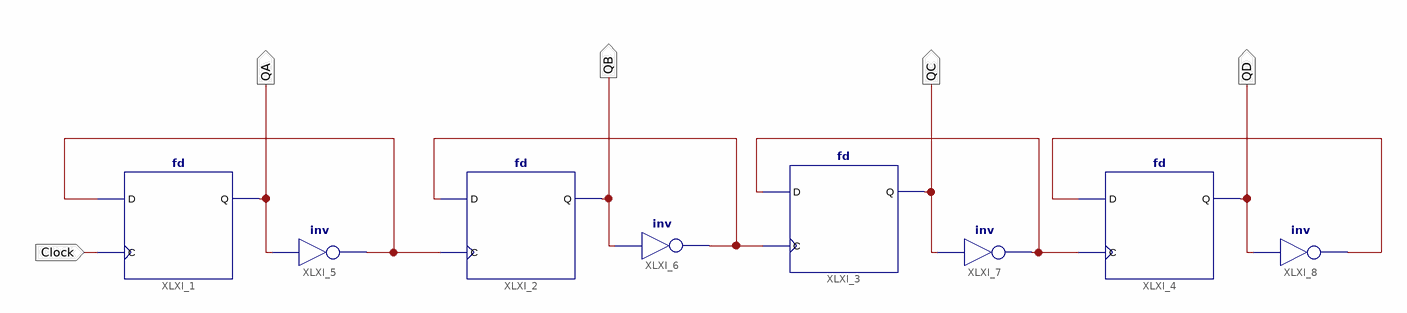
[diagram p0: schematic sheet 1]
// Xilinx ISE schematic counter.sch (spartan3a) as structural Verilog: 8 symbols, 5 ports
module counter (
  input  Clock,
  output QB,
  output QC,
  output QD,
  output QA
);

  wire XLXN_14, XLXN_15, XLXN_23, XLXN_26;

  fd XLXI_2 (.C(XLXN_26), .D(XLXN_23), .Q(QB));
  not XLXI_6 (XLXN_23, QB);
  fd XLXI_3 (.C(XLXN_23), .D(XLXN_15), .Q(QC));
  not XLXI_7 (XLXN_15, QC);
  fd XLXI_4 (.C(XLXN_15), .D(XLXN_14), .Q(QD));
  not XLXI_8 (XLXN_14, QD);
  fd XLXI_1 (.C(Clock), .D(XLXN_26), .Q(QA));
  not XLXI_5 (XLXN_26, QA);
endmodule
